# EAGLE design SparkFun_Pro_Micro-FP (EAGLE 9.5.1)
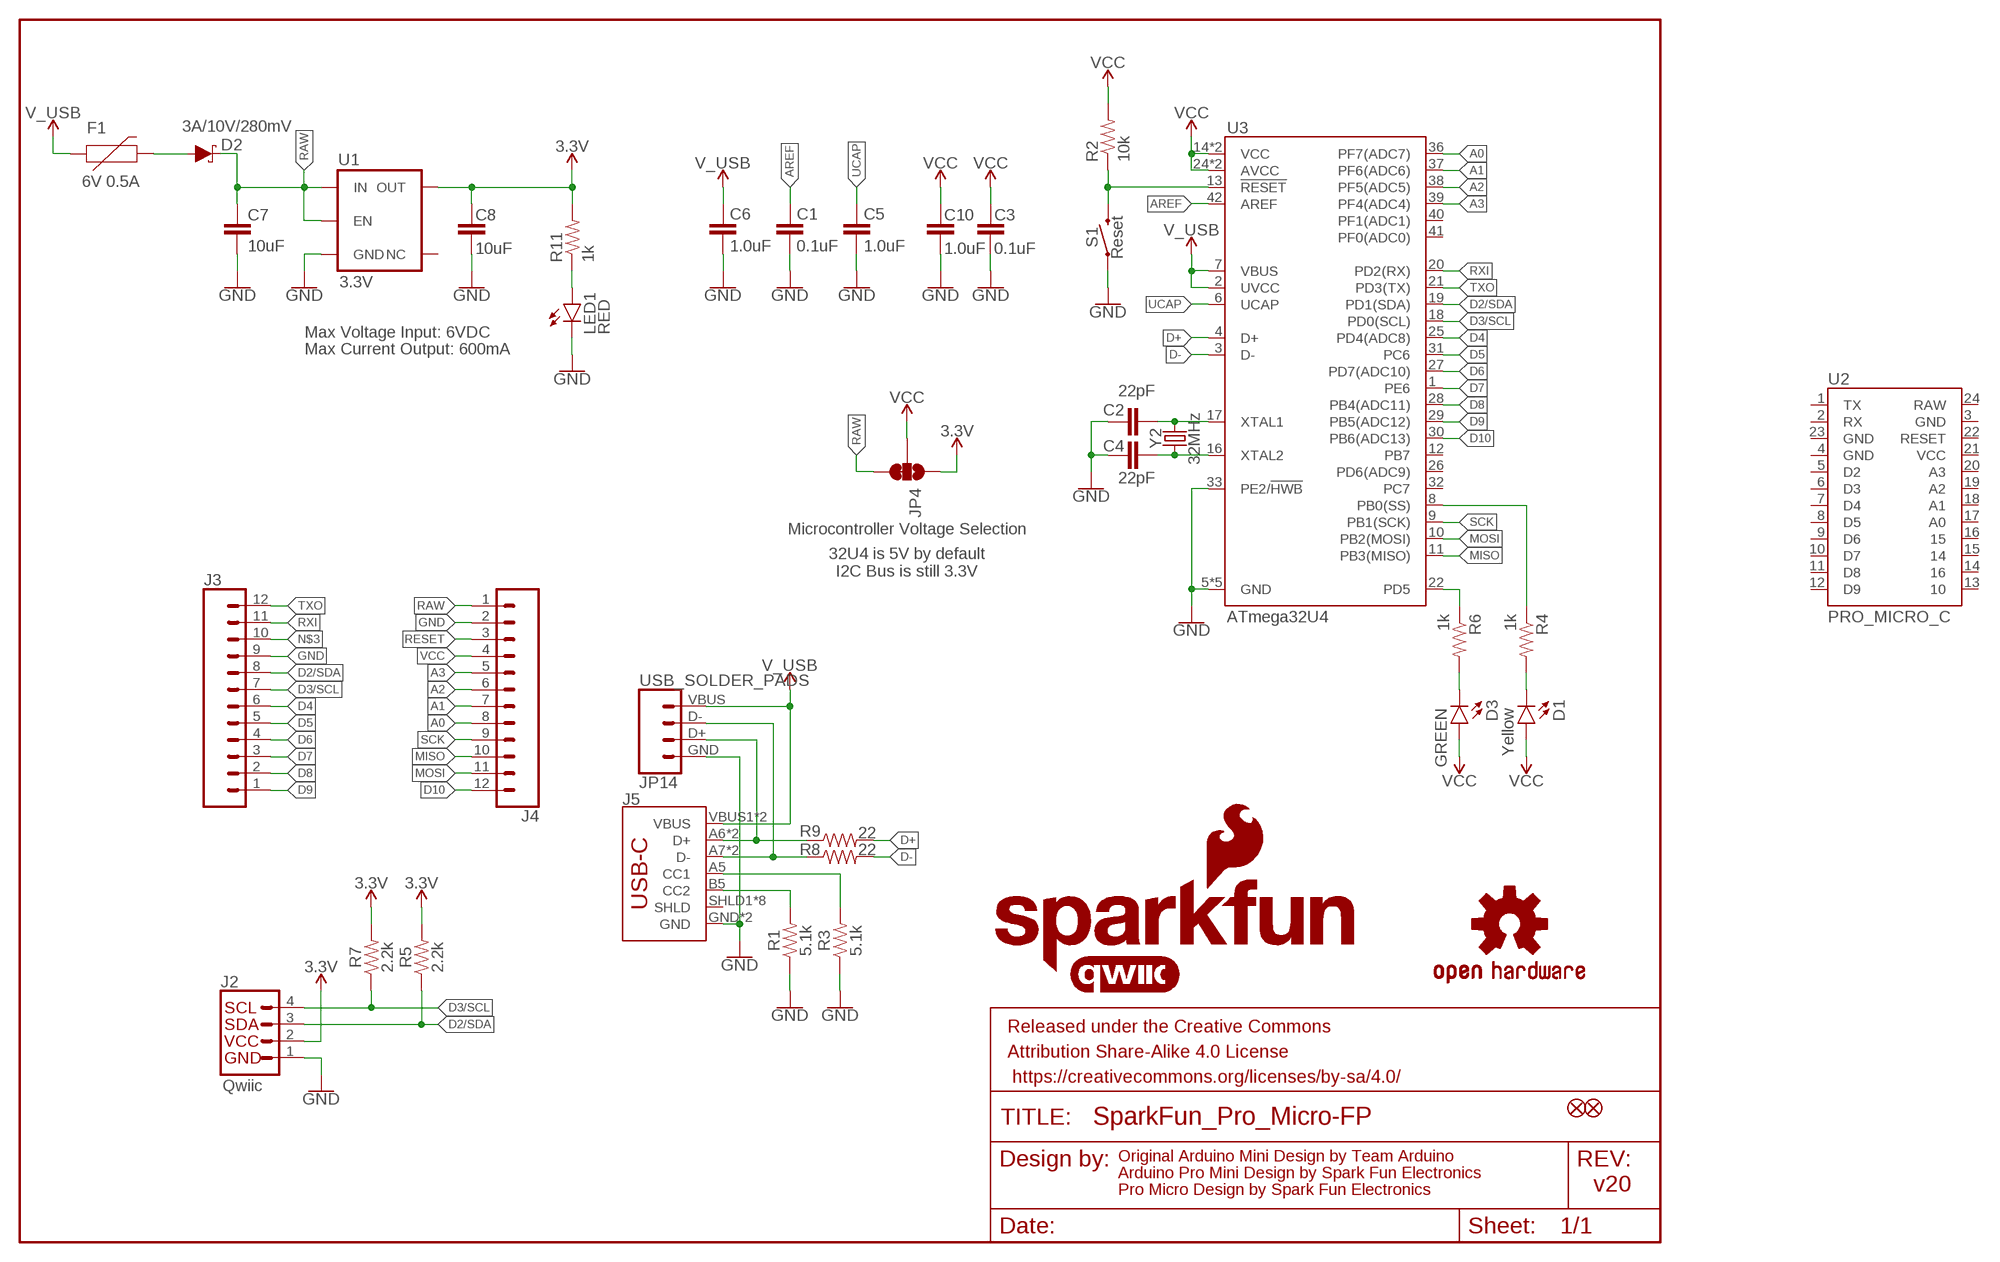
[diagram p0: schematic, sheet 1]

## Parts
C1  0.1uF  0.1UF-0402T-16V-10%  [0402-TIGHT]
C2  22pF  22PF-0402T-16V-10%  [0402-TIGHT]
C3  0.1uF  0.1UF-0402T-16V-10%  [0402-TIGHT]
C4  22pF  22PF-0402T-16V-10%  [0402-TIGHT]
C5  1.0uF  1.0UF-0402T-16V-10%  [0402-TIGHT]
C6  1.0uF  1.0UF-0402T-16V-10%  [0402-TIGHT]
C7  10uF  10UF-0603-6.3V-20%  [0603]
C8  10uF  10UF-0603-6.3V-20%  [0603]
C10  1.0uF  1.0UF-0402T-16V-10%  [0402-TIGHT]
D1  Yellow  LED-YELLOW0603  [LED-0603]
D2  3A/10V/280mV  DIODE-SCHOTTKY-BAT60A  [SOD-323]
D3  GREEN  LED-GREEN0603  [LED-0603]
F1  6V 0.5A  PPTC_6V500MA  [0805]
FRAME1  FRAME-LETTER  [CREATIVE_COMMONS]
J2  Qwiic  QWIIC_CONNECTORJS-1MM  [JST04_1MM_RA]
J3  CONN_12CASTLE  [1X12_CASTELLATED]
J4  CONN_12CASTLE  [1X12_CASTELLATED]
J5  USB_C5  [USB-C-16P-5]
JP1  FIDUCIAL1X2  [FIDUCIAL-1X2]
JP2  FIDUCIAL1X2  [FIDUCIAL-1X2]
JP4  JUMPER-SMT_3_1-NC_TRACE_SILK  [SMT-JUMPER_3_1-NC_TRACE_SILK]
JP14  USB_SOLDER_PADS  [USB-SOLDER-PADS]
LED1  RED  LED-RED0603  [LED-0603]
LOGO1  SFE_LOGO_NAME_FLAME.1_INCH  [SFE_LOGO_NAME_FLAME_.1]
LOGO2  QWIIC_LOGO_4MM  [QWIIC_4MM]
LOGO3  QWIIC_LOGO_6MM  [QWIIC_6MM]
LOGO4  SFE_LOGO_FLAME.1_INCH  [SFE_LOGO_FLAME_.1]
R1  5.1k  5.1KOHM-0402T-1/16W-1%  [0402-TIGHT]
R2  10k  10KOHM-0402T-1/16W-1%  [0402-TIGHT]
R3  5.1k  5.1KOHM-0402T-1/16W-1%  [0402-TIGHT]
R4  1k  1KOHM-0402T-1/16W-1%  [0402-TIGHT]
R5  2.2k  2.2KOHM-0402T-1/16W-1%  [0402-TIGHT]
R6  1k  1KOHM-0402T-1/16W-1%  [0402-TIGHT]
R7  2.2k  2.2KOHM-0402T-1/16W-1%  [0402-TIGHT]
R8  22  22OHM-0402T-1/16W-1%  [0402-TIGHT]
R9  22  22OHM-0402T-1/16W-1%  [0402-TIGHT]
R11  1k  1KOHM-0402T-1/16W-1%  [0402-TIGHT]
S1  Reset  MOMENTARY-SWITCH-SPST-SMD-4.6X2.8MM  [TACTILE_SWITCH_SMD_4.6X2.8MM]
U1  3.3V  V_REG_AP2112K-3.3V  [SOT23-5]
U2  PRO_MICRO_C  [PRO_MICRO_C]
U3  ATmega32U4  ATMEGA32U41:1  [QFN-44-NOPAD_1:1]
U$3  OSHW-LOGOMINI  [OSHW-LOGO-MINI]
Y2  32MHz  CRYSTAL-32MHZ-SMD-2.0X1.6MM  [CRYSTAL-SMD-2.0X1.6MM]

## Nets
3.3V: C8.2 J2.2 JP4.1 R5.2 R7.2 R11.2 U1.5(OUT)
A0: J4.8 U3.36(PF7(ADC7))
A1: J4.7 U3.37(PF6(ADC6))
A2: J4.6 U3.38(PF5(ADC5))
A3: J4.5 U3.39(PF4(ADC4))
AREF: C1.2 U3.42(AREF)
D2/SDA: J2.3 J3.8 R5.1 U3.19(PD1(SDA))
D3/SCL: J2.4 J3.7 R7.1 U3.18(PD0(SCL))
D4: J3.6 U3.25(PD4(ADC8))
D5: J3.5 U3.31(PC6)
D6: J3.4 U3.27(PD7(ADC10))
D7: J3.3 U3.1(PE6)
D8: J3.2 U3.28(PB4(ADC11))
D9: J3.1 U3.29(PB5(ADC12))
D10: J4.12 U3.30(PB6(ADC13))
D+: R9.2 U3.4(D+)
D-: R8.2 U3.3(D-)
D-_HV: J5.A7(D-) J5.B7(D-) JP14.D- R8.1
DP_HV: J5.A6(D+) J5.B6(D+) JP14.D+ R9.1
GND: C1.1 C2.2 C3.1 C4.2 C5.1 C6.1 C7.1 C8.1 C10.1 J2.1 J3.9 J4.2 J5.GND J5.GND2(GND) JP14.GND LED1.C R1.1 R3.1 S1.1 S1.2 U1.2(GND) U3.5(GND) U3.15(GND) U3.23(GND) U3.33(PE2/!HWB) U3.35(GND) U3.43(GND)
MISO: J4.10 U3.11(PB3(MISO))
MOSI: J4.11 U3.10(PB2(MOSI))
N$1: C4.1 U3.16(XTAL2) Y2.1
N$2: C2.1 U3.17(XTAL1) Y2.3
N$3: J3.10
N$5: D1.C R4.2
N$7: D3.C R6.2
N$9: J5.A5(CC1) R3.2
N$10: J5.B5(CC2) R1.2
N$38: LED1.A R11.1
RAW [vcc]: C7.2 D2.C J4.1 JP4.3 U1.1(IN) U1.3(EN)
RESET: J4.3 R2.1 S1.3 S1.4 U3.13(!RESET)
RXI: J3.11 U3.20(PD2(RX))
RXLED: R4.1 U3.8(PB0(SS))
SCK: J4.9 U3.9(PB1(SCK))
TXLED: R6.1 U3.22(PD5)
TXO: J3.12 U3.21(PD3(TX))
UCAP: C5.2 U3.6(UCAP)
USB_RAW: D2.A F1.2
V_USB: C6.2 F1.1 J5.VBUS1(VBUS) J5.VBUS2(VBUS) JP14.VBUS U3.2(UVCC) U3.7(VBUS)
VCC: C3.2 C10.2 D1.A D3.A J4.4 JP4.2 R2.2 U3.14(VCC) U3.24(AVCC) U3.34(VCC) U3.44(AVCC)
Unconnected: J5.SHLD1(SHLD) J5.SHLD2(SHLD) J5.SHLD3(SHLD) J5.SHLD4(SHLD) J5.SHLD5(SHLD) J5.SHLD6(SHLD) J5.SHLD7(SHLD) J5.SHLD8(SHLD) U1.4(NC) U2.1(TX) U2.2(RX) U2.3(GND) U2.4(GND) U2.5(D2) U2.6(D3) U2.7(D4) U2.8(D5) U2.9(D6) U2.10(D7) U2.11(D8) U2.12(D9) U2.13 U2.14 U2.15 U2.16 U2.17(A0) U2.18(A1) U2.19(A2) U2.20(A3) U2.21(VCC) U2.22(RESET) U2.23(GND) U2.24(RAW) U3.12(PB7) U3.26(PD6(ADC9)) U3.32(PC7) U3.40(PF1(ADC1)) U3.41(PF0(ADC0))

## Notes on the sheet
- Max Voltage Input: 6VDC
- Max Current Output: 600mA
- Microcontroller Voltage Selection
- 32U4 is 5V by default
  I2C Bus is still 3.3V
- Original Arduino Mini Design by Team Arduino
- Arduino Pro Mini Design by Spark Fun Electronics
- Pro Micro Design by Spark Fun Electronics | v20

## Library data of the parts
C1 C3 = SparkFun-Capacitors:0.1UF: 0.1µF ceramic capacitors A capacitor is a passive two-terminal electrical component used to store electrical energy temporarily in an electric field.; PROD_ID: CAP-12416
C2 C4 = SparkFun-Capacitors:22PF: 22pF ceramic capacitors A capacitor is a passive two-terminal electrical component used to store electrical energy temporarily in an electric field.; PROD_ID: CAP-14674
C5 C6 C10 = SparkFun-Capacitors:1.0UF: 1µF ceramic capacitors A capacitor is a passive two-terminal electrical component used to store electrical energy temporarily in an electric field.; PROD_ID: CAP-12417
C7 C8 = SparkFun-Capacitors:10UF: 10.0µF ceramic capacitors A capacitor is a passive two-terminal electrical component used to store electrical energy temporarily in an electric field.; PROD_ID: CAP-11015
D1 = SparkFun-LED:LED-YELLOW: Yellow SMD LED Used in manufacturing several products at SparkFun. Packages: 0603 - SMD 0603 package[Product Link] <http://www.kingbrightusa.com/product.asp?catalog_name=LED&product_id=APT1608SYCK> 0603 -SMART - SMART SMD 0603 package (more efficient/more expensive) [Product Link] <http://www.osram-os.com/osram_os/en/products/product-catalog/led-light-emitting-diodes/smartled-0603/ly-l29k/index.jsp> LilyPad - SMD1206 package[Product Datasheet] <https://www.sparkfun.com/datasheets/DevTools/LilyPad/Q150YUS4.pdf> SparkFun Products: Blynk Board <https://www.sparkfun.com/products/13794> IOIO-OTG <https://www.sparkfun.com/products/13613> XBee Explorer Serial <https://www.sparkfun.com/products/13225>; PROD_ID: DIO-09003
D2 = SparkFun-DiscreteSemi:DIODE-SCHOTTKY: Schottky diode A Schottky diode is a semiconductor diode which has a low forward voltage drop and a very fast switching action.; PROD_ID: DIO-14072
D3 = SparkFun-LED:LED-GREEN: Green SMD LED Used in manufacturing of various products at SparkFun Packages: 0603 - SMD 0603 package [Product Link] <http://www.futureelectronics.com/en/technologies/semiconductors/optoelectronics/leds/Pages/9894312-LTST-C190GKT.aspx?CrossPart=HSMG-C190&IM=0> LilyPad 1206 - SMD1206 LilyPad package [Product Link] <http://www.futureelectronics.com/en/Technologies/Product.aspx?ProductID=IN150NGHARVATEKCORPORATION2049943&IM=0> 1206 - SMD1206 package [Product Link] <http://www.futureelectronics.com/en/technologies/semiconductors/optoelectronics/leds/Pages/8315665-LTST-C150KGKT.aspx?IM=0> 1206 Bottom Mount -SMD 1206 Bottom Mount [Product Link] <http://www.digikey.com/product-detail/en/lite-on-inc/LTST-C230KGKT/160-1456-1-ND/386854> SparkFun Products: Pro Mini 328 -5V <https://www.sparkfun.com/products/821> RedBoard <https://www.sparkfun.com/products/12757> MP3 Trigger <https://www.sparkfun.com/products/13720> Makey Makey <https://www.sparkfun.com/products/11076>; PROD_ID: DIO-00821
F1 = SparkFun-Fuses:PPTC: Resettable Fuse PPTC Resettable Fuse. Really a sort of resistor with a polymeric positive temperature coefficient whose resistance increases dramatically with an increase in temperature. When heated by the power passing through the resistance rises causing the current to be limited, protecting the circuit. This is achieved by the transition of the polymer from a crystalline to an amorphous state where the conductive carbon separates breaking the conductive pathways found in the cool crystalline structure. When a PPTC cools back down it resumes conducting letting the circuit turn back on. SparkFun Products: SparkFun RedBoard - Programmed with Arduino <https://www.sparkfun.com/products/12757> Pro Micro - 5V/16MHz <https://www.sparkfun.com/products/12640> Arduino Pro 328 - 5V/16MHz <https://www.sparkfun.com/products/10915> MP3 Trigger <https://www.sparkfun.com/products/13720>; PROD_ID: RES-13945
FRAME1 = SparkFun-Aesthetics:FRAME-LETTER: Schematic Frame - Letter Standard 8.5x11 US Letter frame
J2 = SparkFun-Connectors:QWIIC_CONNECTOR: SparkFun I2C Standard Qwiic Connector An SMD 1mm pitch JST connector makes it easy and quick (get it? Qwiic?) to connect I2C devices to each other. The Qwiic system <http://www.sparkfun.com/qwiic> enables fast and solderless connection between popular platforms and various sensors and actuators. We carry 200mm <https://www.sparkfun.com/products/14204>, 100mm <https://www.sparkfun.com/products/14205>, 50mm <https://www.sparkfun.com/products/14206>, and breadboard friendly <https://www.sparkfun.com/products/14207> Qwiic cables. We also offer 10 pcs strips <https://www.sparkfun.com/products/14323> the SMD connectors.; PROD_ID: CONN-13694; VALUE: QWIIC_RIGHT_ANGLE
J3 J4 = Castellated:CONN_12: Multi connection point. Often used as Generic Header-pin footprint for 0.1 inch spaced/style header connections On any of the 0.1 inch spaced packages, you can populate with these: Break Away Headers - Straight <https://www.sparkfun.com/products/116> (PRT-00116) Break Away Male Headers - Right Angle <https://www.sparkfun.com/products/553> (PRT-00553) Female Headers <https://www.sparkfun.com/products/115> (PRT-00115) Break Away Headers - Machine Pin <https://www.sparkfun.com/products/117> (PRT-00117) Break Away Female Headers - Swiss Machine Pin <https://www.sparkfun.com/products/743> (PRT-00743) For SCREWTERMINALS and SPRING TERMINALS visit here: Screw Terimnals on SparkFun.com <https://www.sparkfun.com/search/results?term=Screw+Terminals> (5mm/3.5mm/2.54mm spacing) This device is also useful as a general connection point to wire up your design to another part of your project. Our various solder wires solder well into these plated through hole pads. Hook-Up Wire - Assortment (Stranded, 22 AWG) <https://www.sparkfun.com/products/11375> (PRT-11375) Hook-Up Wire - Assortment (Solid Core, 22 AWG) <https://www.sparkfun.com/products/11367> (PRT-11367) View the entire wire category on our website here <https://www.sparkfun.com/categories/141> Special notes: Molex polarized connector foot print use with SKU : PRT-08231 with associated crimp pins and housings. 1MM SMD Version SKU: PRT-10208 NOTES ON THE VARIANTS LOCK and LOCK_LONGPADS... This footprint was designed to help hold the alignment of a through-hole component (i.e. 6-pin header) while soldering it into place. You may notice that each hole has been shifted either up or down by 0.005 of an inch from it's more standard position (which is a perfectly straight line). This slight alteration caused the pins (the squares in the middle) to touch the edges of the holes. Because they are alternating, it causes a "brace" to hold the component in place. 0.005 has proven to be the perfect amount of "off-center" position when using our standard breakaway headers. Although looks a little odd when you look at the bare footprint, once you have a header in there, the alteration is very hard to notice. Also,if you push a header all the way into place, it is covered up entirely on the bottom side.
J5 = USBC:USB_C: USB Type C 16Pin Connector Super Speed pins not available on the 16-pin purely SMD connector so this part is best for USB 2.0 implementations. D1 and D2 are tied together enabling D+/- no matter which way the cable is plugged into the connector. The two channel configuration pins (CC1/2) are exposed. These are normally connected to ground via 5.1k resistors but can be reconfigured for high current/high power applications.
JP1 JP2 = SparkFun-Aesthetics:FIDUCIAL: Fiducial Alignment Points Point-of-reference for pick-and-place machines and other optical instruments.
JP4 = SparkFun-Jumpers:JUMPER-SMT_3_1-NC_TRACE: Normally closed trace jumper (1 of 2 connections) This jumper has a trace between two pads so it's normally closed (NC). The other connection is normally open (NO). Use a razor knife to open the connection. For best results follow the IPC guidelines for cutting traces: Cutout at least 0.063 mm (0.005 in). Remove all loose material to clean up the cut area. Seal the cut with an approved epoxy. Reapply solder to reclose the connection, or to close the NO connection.
JP14 = SparkFun-Connectors:USB_SOLDER_PADS: Solder pad access to USB pins. Helpful to expose on PCBs so user can attach external USB connector if necessary.
LED1 = SparkFun-LED:LED-RED: Red SMD LED Used in manufacturing of most products at SparkFun Packages: 0603 - SMD 0603 package [Product Link] <http://docs.avagotech.com/docs/AV02-0551EN> 0603 SMART - SMD 0603 SMART package ( more efficient and expensive)[Product Link] <http://www.osram-os.com/Graphics/XPic2/00077099_0.pdf> 1206 - SMD1206 package [Product Link] <https://www.sparkfun.com/datasheets/DevTools/LilyPad/Q150OVS4.pdff> SparkFun Products: Pro Mini 328 -5V <https://www.sparkfun.com/products/821> RedBoard <https://www.sparkfun.com/products/12757> IOIO-OTG <https://www.sparkfun.com/products/13613>; PROD_ID: DIO-00819
LOGO1 = SparkFun-Aesthetics:SFE_LOGO_NAME_FLAME: SparkFun Font Logo w/ Flame This is the SparkFun full logo. The logo on the schematic will always be the same size; the package variant is the height of the flame part of the logo. Default layer for the logo on the board is tSilk.
LOGO2 LOGO3 = SparkFun-Aesthetics:QWIIC_LOGO: Qwiic Logos for placement on schematic and PCB. The 5.5mm silk logo is best for placing next to Qwiic connector.
LOGO4 = SparkFun-Aesthetics:SFE_LOGO_FLAME: SparkFun Flame Logo This is the SparkFun flame logo. The logo on the schematic will always be the same size; the package variant is the height of the flame. Default layer for the logo on the board is tSilk.
R1 R3 = SparkFun-Resistors:5.1KOHM; PROD_ID: RES-14340
R2 = SparkFun-Resistors:10KOHM: 10kΩ resistor A resistor is a passive two-terminal electrical component that implements electrical resistance as a circuit element. Resistors act to reduce current flow, and, at the same time, act to lower voltage levels within circuits. - Wikipedia; PROD_ID: RES-14241
R4 R6 R11 = SparkFun-Resistors:1KOHM: 1kΩ resistor A resistor is a passive two-terminal electrical component that implements electrical resistance as a circuit element. Resistors act to reduce current flow, and, at the same time, act to lower voltage levels within circuits. - Wikipedia; PROD_ID: RES-14342
R5 R7 = SparkFun-Resistors:2.2KOHM: 2.2kΩ resistor A resistor is a passive two-terminal electrical component that implements electrical resistance as a circuit element. Resistors act to reduce current flow, and, at the same time, act to lower voltage levels within circuits. - Wikipedia; PROD_ID: RES-14341
R8 R9 = SparkFun-Resistors:22OHM: 22Ω resistor A resistor is a passive two-terminal electrical component that implements electrical resistance as a circuit element. Resistors act to reduce current flow, and, at the same time, act to lower voltage levels within circuits. - Wikipedia; PROD_ID: RES-14340
S1 = SparkFun-Switches:MOMENTARY-SWITCH-SPST: Momentary Switch (Pushbutton) - SPST Normally-open (NO) SPST momentary switches (buttons, pushbuttons). Variants PTH-12MM - 12mm square, through-hole Momentary Pushbutton Switch - 12mm Square <https://www.sparkfun.com/products/9190> (COM-09190) PTH-6.0MM, PTH-6.0MM-KIT - 6.0mm square, through-hole Mini Pushbutton Switch <https://www.sparkfun.com/products/97> (COM-00097) KIT package intended for soldering kit's - only one side of pads' copper is exposed. PTH-RIGHT-ANGLE-KIT - Right-angle, through-hole Right Angle Tactile Button <https://www.sparkfun.com/products/10791> - Used on SparkFun BigTime Watch Kit <https://www.sparkfun.com/products/11734> SMD-12MM - 12mm square, surface-mount Tactile Button - SMD (12mm) <https://www.sparkfun.com/products/12993> (COM-12993) Used on SparkFun PicoBoard <https://www.sparkfun.com/products/11888> SMD-4.5MM - 4.5mm Square Trackball Switch Used on SparkFun Blackberry Trackballer Breakout <https://www.sparkfun.com/products/13169> SMD-4.6MMX2.8MM - 4.60mm x 2.80mm, surface mount Used on SparkFun SAMD21 Mini Breakout <https://www.sparkfun.com/products/13664> SMD-5.2MM, SMD-5.2-REDUNDANT - 5.2mm square, surface-mount Mini Pushbutton Switch - SMD <https://www.sparkfun.com/products/8720> (COM-08720) Used on Arduino Pro Mini <https://www.sparkfun.com/products/11114> REDUNDANT package connects both switch circuits together SMD-6.0X3.5MM - 6.0 x 3.5mm, surface mount Momentary Reset Switch SMD <https://www.sparkfun.com/products/8229> (COM-08229) SMD-6.2MM-TALL - 6.2mm square, surface mount Tactile Button - SMD (6mm) <https://www.sparkfun.com/products/12992> Used on SparkFun Digital Sandbox <https://www.sparkfun.com/products/12651> SMD-RIGHT-ANGLE - Right-angle, surface mount Used on SparkFun Block for Intel® Edison - Arduino <https://www.sparkfun.com/products/13036>; PROD_ID: SWCH-13065
U1 = SparkFun-IC-Power:V_REG_AP2112: AP2112 - 600mA CMOS LDO Regulator w/ Enable The AP2112 is CMOS process low dropout linear regulator with enable function, the regulator delivers a guaranteed 600mA (min.) continuous load current. Features Output Voltage Accuracy: ±1.5% Output Current: 600mA (Min.) Foldback Short Current Protection: 50mA Enable Function to Turn ON/OFF VOUT Low Dropout Voltage (3.3V): 250mV (Typ.) @IOUT=600mA Excellent Load Regulation: 0.2%/A (Typ.) Excellent Line Regulation: 0.02%/V (Typ.) Low Quiescent Current: 55μA (Typ.) Low Standby Current: 0.01μA (Typ.) Low Output Noise: 50μVRMS PSRR: 100Hz -65dB, 1kHz -65dB OTSD Protection Stable with 1.0μF Flexible Cap: Ceramic, Tantalum and Aluminum Electrolytic Operation Temperature Range: -40°C to 85°C ESD: MM 400V, HBM 4000V; PROD_ID: VREG-12457
U2 = Castellated:PRO_MICRO_C
U3 = SparkFun-IC-Microcontroller:ATMEGA32U4: Atmel MCU, 32KByte Atmel 44-pin 8-bit Microcontroller with 32KBytes of ISP Flash and USB Controller Datasheet <http://cdn.sparkfun.com/datasheets/Dev/Arduino/Boards/ATMega32U4.pdf> SparkFun Products LilyPad Arduino USB - ATmega32U4 Board <https://www.sparkfun.com/products/12049> (DEV-12049) Pro Micro - 5V/16MHz <https://www.sparkfun.com/products/12640> (DEV-12640) Pro Micro - 3.3V/8MHz <https://www.sparkfun.com/products/12587> (DEV-12587) Fio v3 - ATmega32U4 <https://www.sparkfun.com/products/11520> (DEV-11520) Qduino Mini <https://www.sparkfun.com/products/13614> (DEV-13614) Makey Makey - Standard Kit <https://www.sparkfun.com/products/11511> (WIG-11511) Makey Makey Deluxe Kit <https://www.sparkfun.com/products/11519> (WIG-11519); PROD_ID: IC-10828; VALUE: 32U4
U$3 = SparkFun-Aesthetics:OSHW-LOGO: Open-Source Hardware (OSHW) Logo This logo indicates the piece of hardware it is found on incorporates a OSHW license and/or adheres to the definition of open source hardware found here: http://freedomdefined.org/OSHW
Y2 = SparkFun-Clocks:CRYSTAL-32MHZ: 32MHz Crystal Digikey Example <http://www.digikey.com/product-detail/en/murata-electronics-north-america/XRCGB32M000F2P00R0/490-9769-1-ND/4952013> Frequency: 32MHz Frequency Stability: ±20ppm Frequency Tolerance: ±20ppm Load Capacitance: 6pF SparkFun Products SparkFun nRF52832 Breakout <https://www.sparkfun.com/products/13990>; PROD_ID: XTAL-13459

## Board
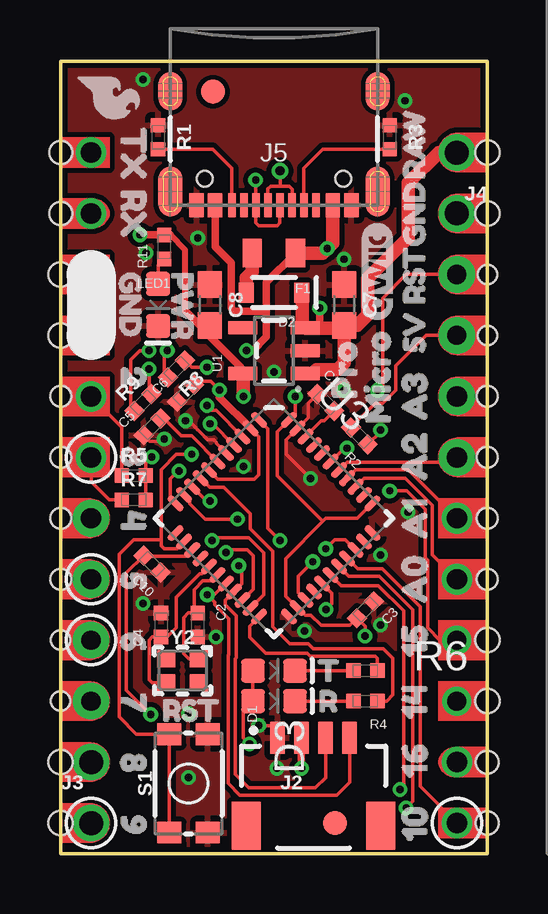
[diagram p1: board, top side]
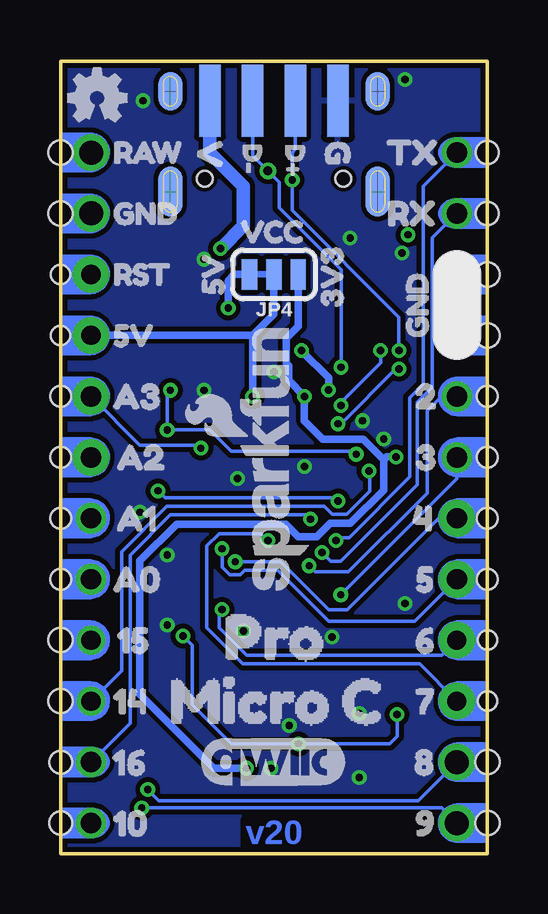
[diagram p2: board, bottom side, seen from below]

Size 17.78 x 33.02 mm. Coordinates in mm from the lower left corner, seen from the top.
Outline: 0,33.02 0,0 17.78,0 17.78,33.02 0,33.02
Copper layers (1*16): Top 0.035mm / dielectric 1.5mm / Bottom 0.035mm
Design rules "SparkFun-2-layer-PCBWay-LIMIT": minimum track width 6mil, minimum drill 0.3mm, track to track 6mil, track to pad 6mil, pad to pad 6mil, via to via 6mil, smd to smd 6mil, copper to edge 6mil, drill to drill 6mil, minimum pad ring 6mil, minimum via ring 6mil, stop-mask expansion 4mil, vias tented up to drill 25mil, thermal gap 10mil

### Footprints (pad centres in the part's own frame; a part is rotated, then mirrored left to right if it is on the bottom)
0402-TIGHT = smd 0.6 x 0.6: 1 -0.5,0; 2 0.5,0
0603 = smd 1.1 x 1: 1 -0.85,0; 2 0.85,0
LED-0603 = smd 1 x 1: A -0.877,0; C 0.877,0
SOD-323 = smd 0.63 x 0.83: A 1.15,0; C -1.15,0
0805 = smd 0.8 x 1.2: 1 -0.9,0; 2 0.9,0
JST04_1MM_RA = smd 0.6 x 1.35: 1 -1.5,0; 2 -0.5,0; 3 0.5,0; 4 1.5,0 | smd 1.2 x 2: NC1 2.8,-3.675; NC2 -2.8,-3.675
1X12_CASTELLATED = drill 1 pad 1.524: 1 0,0; 2 0,2.54 | drill 0.8 pad 1.524: 3 0,5.08; 4 0,7.62 | drill 0.85 pad 1.524: 5 0,10.16; 6 0,12.7 | drill 0.85 pad 1.016: 7 0,15.24; 8 0,17.78; 11 0,25.4; 12 0,27.94 | drill 0.8 pad 1.016: 9 0,20.32; 10 0,22.86 | hole 1: -1.27,2.54; -1.27,0; -1.27,20.32; -1.27,22.86 | hole 0.8: -1.27,5.08; -1.27,7.62 | hole 0.85: -1.27,10.16; -1.27,12.7; -1.27,15.24; -1.27,17.78 | hole 0.95: -1.27,25.4; -1.27,27.94
USB-C-16P-5 = smd 0.3 x 1: A5 -1.25,-0.34; A6 -0.25,-0.34; A7 0.25,-0.34; A8 1.25,-0.34; B5 1.75,-0.34; B6 0.75,-0.34; B7 -0.75,-0.34; B8 -1.75,-0.34 | smd 0.6 x 1: GND -3.225,-0.34; GND2 3.225,-0.34; VBUS1 -2.45,-0.34; VBUS2 2.45,-0.34 | smd 1 x 2.1: SHLD1 -4.32,-0.915; SHLD2 4.32,-0.915 | smd 1 x 2.1 bottom: SHLD3 -4.32,-0.915; SHLD4 4.32,-0.915 | smd 1 x 1.6: SHLD5 -4.32,-5.095; SHLD8 4.32,-5.095 | smd 1 x 1.6 bottom: SHLD6 -4.32,-5.095; SHLD7 4.32,-5.095 | hole 0.65: -2.89,-1.445; 2.89,-1.445
FIDUCIAL-1X2 = smd 1 x 1: 1 0,0
SMT-JUMPER_3_1-NC_TRACE_SILK = smd 0.635 x 1.27: 1 -1.016,0; 2 0,0; 3 1.016,0
USB-SOLDER-PADS = smd 3 x 0.9: D+ 0,-0.889; D- 0,0.889; GND 0,-2.667; VBUS 0,2.667
TACTILE_SWITCH_SMD_4.6X2.8MM = smd 0.9 x 1: 1 -2.05,-0.8; 2 2.05,-0.8; 3 2.05,0.8; 4 -2.05,0.8
SOT23-5 = smd 0.55 x 1.2: 1 -0.95,-1.3; 2 0,-1.3; 3 0.95,-1.3; 4 0.95,1.3; 5 -0.95,1.3
PRO_MICRO_C = smd 1.524 x 1.27: 1 -8.89,12.7; 2 -8.89,10.16; 3 -8.89,7.62; 13 8.89,-15.24; 14 8.89,-12.7; 15 8.89,-10.16; 16 8.89,-7.62 | smd 1.524 x 1.524: 4 -8.89,5.08; 5 -8.89,2.54; 6 -8.89,0; 7 -8.89,-2.54 | smd 2.032 x 1.524: 8 -8.89,-5.08; 9 -8.89,-7.62; 10 -8.89,-10.16; 11 -8.89,-12.7; 12 -8.89,-15.24 | smd 2.54 x 2.032: 17 8.89,-5.08; 18 8.89,-2.54; 19 8.89,0; 20 8.89,2.54 | smd 2.54 x 1.27: 21 8.89,5.08; 22 8.89,7.62 | smd 2.032 x 1.27: 23 8.89,10.16; 24 8.89,12.7
QFN-44-NOPAD_1:1 = smd 0.8 x 0.3: 1 -3.337,2.458; 2 -3.337,1.958; 3 -3.337,1.479; 4 -3.337,0.979; 5 -3.337,0.5; 6 -3.337,0; 7 -3.337,-0.5; 8 -3.337,-0.979; 9 -3.337,-1.479; 10 -3.337,-1.958; 11 -3.337,-2.458; 23 3.337,-2.458; 24 3.337,-1.958; 25 3.337,-1.479; 26 3.337,-0.979; 27 3.337,-0.5; 28 3.337,0; 29 3.337,0.5; 30 3.337,0.979; 31 3.337,1.479; 32 3.337,1.958; 33 3.337,2.458 | smd 0.3 x 0.8: 12 -2.458,-3.337; 13 -1.958,-3.337; 14 -1.479,-3.337; 15 -0.979,-3.337; 16 -0.5,-3.337; 17 0,-3.337; 18 0.5,-3.337; 19 0.979,-3.337; 20 1.479,-3.337; 21 1.958,-3.337; 22 2.458,-3.337; 34 2.458,3.337; 35 1.958,3.337; 36 1.479,3.337; 37 0.979,3.337; 38 0.5,3.337; 39 0,3.337; 40 -0.5,3.337; 41 -0.979,3.337; 42 -1.479,3.337; 43 -1.958,3.337; 44 -2.458,3.337
CRYSTAL-SMD-2.0X1.6MM = smd 0.75 x 0.7: 1 -0.675,-0.5; 2 0.675,-0.5; 3 0.675,0.5; 4 -0.675,0.5

### Placement (x,y rotation side)
C1  11.05,18.8 315 top
C2  5.71,9.53 270 top
C3  12.7,10.16 225 top
C4  4.19,9.53 90 top
C5  3.81,17.78 45 top
C6  5.21,19.18 45 top
C7  11.81,22.86 270 top
C8  6.22,22.86 270 top
C10  3.81,12.06 135 top
D1  8.89,6.35 0 top
D2  8.89,23.37 180 top
D3  8.89,7.62 0 top
F1  8.89,25.02 180 top
FRAME1  -17.25,-10.16 0 top  (outside the outline)
J2  10.54,4.83 0 top
J3  1.27,1.27 0 top
J4  16.51,29.21 180 top
J5  8.89,26.67 180 top
JP1  11.43,1.27 0 top
JP2  6.35,31.75 0 top
JP4  8.89,24.13 180 bottom
JP14  8.89,31.37 90 bottom
LED1  4.06,22.86 270 top
LOGO1  8.89,16.51 90 bottom
LOGO2  13.21,24.26 90 top
LOGO3  8.89,3.81 0 bottom
LOGO4  2.03,31.5 270 top
R1  4.06,29.84 270 top
R2  12.45,17.4 135 top
R3  13.72,29.84 270 top
R4  12.7,6.35 180 top
R5  3.05,15.75 0 top
R6  12.7,7.62 180 top
R7  3.05,14.73 0 top
R8  4.83,20.19 225 top
R9  3.43,18.8 45 top
R11  4.32,25.27 90 top
S1  5.33,2.92 90 top
U1  8.89,20.95 90 top
U2  -15.24,16.51 0 top  (outside the outline)
U3  8.89,13.97 315 top
U$1  [VCC1]  11.05,25.91 0 bottom
U$2  [156]  14.73,7.11 90 top
U$3  16.26,31.5 0 bottom
U$4  [164]  14.73,2.29 90 top
U$5  [218]  3.05,21.34 270 top
U$6  [317]  3.05,18.03 270 top
U$7  [515]  3.05,12.83 270 top
U$8  [614]  3.05,10.29 270 top
U$9  [713]  3.05,7.75 270 top
U$10  [812]  3.05,5.08 270 top
U$11  [GND4]  2.92,25.15 270 top
U$12  [RAW5]  14.73,27.3 90 top
U$13  [45]  3.05,15.37 270 top
U$14  [T8]  9.91,7.62 0 top
U$15  [5V1]  16.38,21.59 0 bottom
U$16  [911]  3.05,2.67 270 top
U$17  [A07]  14.73,9.53 90 top
U$18  [TX2]  3.05,31.11 270 top
U$19  [A18]  14.73,12.06 90 top
U$20  [PRODUCTION_INSTRUCTIONS]  20.32,50.8 0 top  (outside the outline)
U$21  [104]  14.73,-0.38 90 top
U$22  [GND4]  14.73,24.38 90 top
U$23  [MICRO1]  13.21,17.02 90 top
U$24  [PRO0]  11.81,18.03 90 top
U$25  [RST3]  3.43,5.97 0 top
U$26  [A29]  14.73,14.48 90 top
U$27  [A310]  14.73,17.14 90 top
U$28  [RX20]  3.05,28.57 270 top
U$29  [145]  14.73,4.7 90 top
U$30  [R9]  9.78,6.35 0 top
U$31  [RST3]  14.73,22.1 90 top
U$32  [GND4]  16.51,26.67 0 bottom
U$34  [A310]  16.51,19.05 0 bottom
U$35  [A29]  16.51,16.51 0 bottom
U$36  [A18]  16.51,13.97 0 bottom
U$37  [A07]  16.51,11.43 0 bottom
U$38  [156]  16.51,8.89 0 bottom
U$39  [3V39]  6.48,21.97 90 bottom
U$40  [C5]  8,6.35 0 bottom
U$41  [RST3]  16.38,24.13 0 bottom
U$42  [G1]  6.22,30.61 270 bottom
U$43  [MICRO4]  14.86,6.35 0 bottom
U$44  [V0]  11.56,30.61 270 bottom
U$45  [PRO3]  12.57,9.02 0 bottom
U$46  [RAW5]  16.38,29.21 0 bottom
U$47  [145]  16.51,6.35 0 bottom
U$48  [164]  16.51,3.81 0 bottom
U$49  [104]  16.51,1.27 0 bottom
U$50  [911]  4.06,1.27 0 bottom
U$51  [812]  3.94,3.81 0 bottom
U$52  [713]  4.06,6.35 0 bottom
U$53  [614]  4.06,8.89 0 bottom
U$54  [515]  4.06,11.43 0 bottom
U$55  [45]  4.19,13.97 0 bottom
U$56  [317]  4.06,16.51 0 bottom
U$57  [218]  4.06,19.05 0 bottom
U$58  [GND4]  2.92,20.57 90 bottom
U$59  [RX20]  5.08,26.67 0 bottom
U$60  [TX2]  5.08,29.21 0 bottom
U$61  [D#3]  8,30.23 270 bottom
U$62  [D#4]  9.78,30.23 270 bottom
U$63  [PWR0]  5.08,25.02 270 top
U$64  [5V1]  11.43,22.48 90 bottom
U$65  [5V1]  14.73,20.07 90 top
Y2  5.08,7.62 0 top

### Tracks (layer width: path | path; a pad name or v marks a point on that pad's centre or on a via)
3.3V  (via drill 0.3)
  Top 0.152: 6.22,21.59 C8.2 | U1.5 7.51,20 | R7.2 R5.2 3.55,16.3 3.78,16.53 v3.8,16.53
  Top 0.254: 5.21,22.6 5.19,22.62 5.19,25.15 4.56,25.77
  Top 0.305: 6.22,21.59 5.97,21.84 | 5.97,21.84 5.21,22.6 | 5.97,21.84 5.97,21.81 7.51,20.27 7.51,20 | 4.56,25.77 R11.2 v3.29,25.77 v3.3,25.78 | v10.03,3.56 10.03,4.82 J2.2
  Top 0.559: U1.5 7.62,19.98 v7.62,19.05
  Bottom 0.305: 4.32,16.41 4.32,15.14 5.71,13.75 6.55,13.75 7.11,13.2 7.87,13.2 8.41,13.73 12.94,13.73 14.48,12.19 14.48,6.63 11.4,3.56 v10.03,3.56 | 4.32,16.41 5.18,17.27 6.86,17.27 7.62,18.03 v7.62,19.05 8.28,19.71 8.28,20.32 8.38,20.42 8.38,21.46 7.87,21.97 JP4.1 | v3.8,16.53 4.2,16.53 4.32,16.41
A0
  Top 0.152: U3.36 12.66,15.65 14.35,15.65 15.49,14.5 15.49,12.45 J4.8
A1
  Top 0.152: U3.37 12.31,16 14.48,16 J4.7
A2
  Top 0.152: U3.38 11.93,16.31 16.31,16.31 J4.6
A3  (via drill 0.3)
  Top 0.152: U3.39 11.81,16.89 v11.94,16.89
  Bottom 0.152: v11.94,16.89 11.94,17.02 14.48,17.02 J4.5
AREF
  Top 0.152: U3.42 10.86,18.03 10.99,18.03 C1.2
D2/SDA  (via drill 0.3)
  Top 0.152: v7.42,11.99 7.55,11.87 7.55,11.25 U3.19 6.86,10.55 6.86,10.36 7.32,9.9 7.32,8.16 7.28,8.13 7.28,3.3 7.84,2.74 10.62,2.74 11.04,3.17 J2.3 | R5.1 2.55,17.77 J3.8
  Bottom 0.152: J3.8 1.91,19.05 2.5,18.45 2.5,15.02 5.79,11.74 7.17,11.74 v7.42,11.99
D3/SCL  (via drill 0.3)
  Top 0.152: U3.18 6.41,10.78 v6.11,10.78 6.43,10.46 6.43,10.36 7.01,9.78 7.01,8.28 6.98,8.25 6.98,2.93 7.47,2.44 11.51,2.44 12.04,2.97 J2.4 | R7.1 2.03,14.73 1.27,15.49 J3.7
  Bottom 0.152: J3.7 1.27,15.62 v6.11,10.78
D4  (via drill 0.3)
  Top 0.152: U3.25 9.91,10.86 9.91,11.56 v10.51,12.16
  Bottom 0.152: v10.51,12.16 8.6,12.16 6.6,10.16 5.84,10.16 2.03,13.97 J3.6
D5  (via drill 0.3)
  Top 0.152: U3.31 11.87,13.08 11.43,13.08 v11.05,12.7
  Bottom 0.152: v11.05,12.7 11.06,12.68 11.04,12.66 11.04,11.94 10.73,11.62 10.29,11.62 10.1,11.81 8.74,11.81 6.6,9.68 3.02,9.68 J3.5
D6  (via drill 0.3)
  Top 0.152: U3.27 11.3,10.85 11.3,10.41 v11.05,10.16
  Bottom 0.152: v11.05,10.16 11.18,10.04 11.18,9.4 10.03,8.26 1.91,8.26 J3.4
D7  (via drill 0.3)
  Top 0.152: U3.1 8.64,17.7 8.64,13.55 v9.14,13.04
  Bottom 0.152: v9.14,13.04 9.44,13.34 11.18,13.34 11.68,12.83 11.68,9.4 10.19,7.9 2.82,7.9 J3.3
D8  (via drill 0.3)
  Top 0.152: U3.28 11.69,11.17 13.24,11.17 14.3,10.11 14.3,2.82 v14.15,2.67
  Bottom 0.152: v14.15,2.67 13.69,2.21 2.87,2.21 J3.2
D9  (via drill 0.3)
  Top 0.152: U3.29 12.01,11.56 13.29,11.56 14.68,10.16 14.68,2.19 v14.4,1.91
  Bottom 0.152: J3.1 1.91,1.91 v14.4,1.91
D10
  Top 0.152: U3.30 12.38,11.86 13.41,11.86 14.99,10.29 14.99,2.79 J4.12
D+  (via drill 0.3)
  Top 0.152: v6.22,17.91 6.34,17.91 U3.4 | R9.2 3.68,19.25 v3.68,20.19
  Bottom 0.152: v6.22,17.91 6.1,17.91 3.81,20.19 v3.68,20.19
D-  (via drill 0.3)
  Top 0.152: U3.3 6.49,18.47 6.3,18.47 v6.1,18.67 | v4.45,20.95 4.32,20.83 4.32,19.99 R8.2
  Bottom 0.152: v6.1,18.67 6.1,18.8 4.45,20.45 v4.45,20.95
D-_HV  (via drill 0.3, 0.38)
  Top 0.152: R8.1 5.46,20.26 v6.1,20.26 | J5.A7 8.64,27.69 8.76,27.81 9.14,27.81 | 9.14,27.81 9.53,27.81 9.65,27.69 9.65,27.02 J5.B7 | v9.14,28.45 9.14,27.81
  Bottom 0.152: v6.1,20.26 6.1,24.33 8.66,26.9 8.66,27.96 v9.14,28.45 9.78,29.08 JP14.D-
DP_HV  (via drill 0.3)
  Top 0.152: v8.13,28.07 8.14,28.05 J5.B6 8.13,27 8.13,26.29 8.26,26.16 9.02,26.16 9.14,26.29 J5.A6 | v3.68,20.95 3.3,20.95 2.92,20.57 2.92,18.6 R9.1
  Bottom 0.152: v3.68,20.95 3.68,22.35 8.13,26.8 v8.13,28.07 8.13,29.21 8,29.34 8,30.48 8.13,30.61 8.13,31.24 JP14.D+
GND  (via drill 0.3)
  Top 0.152: C1.1 10.31,18.77 10.31,18.16 U3.43 9.4,17.25 9.4,16.64 v10.41,15.62 | v5.21,18.03 5.33,17.91 5.47,17.91 6.13,17.25 6.38,17.25 6.48,17.14 6.48,17.09 U3.5 | J2.1 9.04,5.06 8.76,5.33 v8.26,5.33 | C5.1 3.71,17.17 4.22,17.17 v4.32,17.27
  other vias: 5.33,3.17 5.33,5.84 13.34,9.53 3.43,10.41 10.16,9.27 14.48,14.22 11.81,19.3 11.81,24.77 7.62,16.13 5.71,25.65 14.35,31.37 3.43,32.26 6.48,9.02 8.89,20.07 3.56,25.02 9.02,3.56 13.34,12.45
  pour Top (isolate 0.203): 0,33.02 17.78,33.02 17.78,0 0,0
  pour Bottom (isolate 0.203): 0,33.02 17.78,33.02 17.78,0 0,0
MISO  (via drill 0.3)
  Top 0.152: U3.11 4.57,14.81 4.57,15.62 4.89,15.94 v4.93,15.94
  Bottom 0.152: v4.93,15.94 4.9,15.91 4.9,15.1 5.87,14.13 6.45,14.13 6.79,14.46 13.35,14.46 15.24,12.58 15.24,7.62 J4.10
MOSI  (via drill 0.3)
  Top 0.152: U3.10 5.39,14.7 5.39,14.58 6.03,13.93 v7.37,13.93
  Bottom 0.152: v7.37,13.93 7.54,14.11 13.21,14.11 14.88,12.43 14.88,5.44 J4.11
N$1
  Top 0.152: Y2.1 4.4,7.11 3.81,7.11 3.68,7.24 3.68,8.89 3.82,9.03 C4.1 4.45,9.03 4.83,9.4 4.83,10.68 5.8,11.66 5.87,11.66 U3.16
N$2
  Top 0.152: Y2.3 5.34,8.12 5.13,8.33 5.13,9.83 5.33,10.03 C2.1 5.58,10.16 5.58,11 5.93,11.36 6.28,11.36 U3.17
N$5
  Top 0.152: D1.C R4.2
N$7
  Top 0.152: D3.C R6.2
N$9
  Top 0.152: R3.2 10.93,29.34 10.14,28.55 J5.A5
N$10
  Top 0.152: R1.2 6.34,29.34 7.14,28.55 J5.B5
N$38
  Top 0.152: R11.1 4.06,24.52 LED1.A
RAW  (via drill 0.3)
  Top 0.152: D2.C 10.06,23.34
  Top 0.305: v10.79,22.73 10.79,21.88
  Top 0.559: 10.06,23.34 10.06,22.03 U1.3 10.21,21.88 10.79,21.88 11.68,21.88 C7.2 | C7.2 12.36,22.01 12.81,22.46 12.81,23.98 14.48,25.65 14.48,27.94 15.75,29.21 J4.1 | U1.1 10.52,20 10.68,20.17 11.53,20.17 11.81,20.45 C7.2
  Bottom 0.305: JP4.3 10.54,24.13 10.79,23.88 v10.79,22.73
RESET  (via drill 0.3)
  Top 0.152: v13.21,19.3 13.42,19.51 13.42,23.15 14.4,24.13 J4.3 | U3.13 4.85,12.7 4.32,12.7 4.19,12.83 4.19,13.08 | v5.46,16.64 4.83,16.64 4.19,16 4.19,13.08 | S1.4 S1.3 3.16,4.97 2.44,5.69 2.44,12.47 3.05,13.08 4.19,13.08 | R2.1 13.34,17.58 v13.34,17.65
  Bottom 0.152: v5.46,16.64 5.59,16.76 10.67,16.76 11.56,17.65 v13.34,17.65 13.34,19.18 v13.21,19.3
RXI  (via drill 0.3)
  Top 0.152: U3.20 8.03,11.02 8.03,12.41 7.78,12.67 7.02,12.67 v6.89,12.54
  Bottom 0.152: v6.89,12.54 6.52,12.17 6.12,12.17 2.92,15.37 2.92,18.8 2.29,19.43 2.29,25.65 J3.11
RXLED
  Top 0.152: R4.1 13.58,6.35 13.84,6.61 13.84,8.13 13.44,8.53 10.52,8.53 10.32,8.74 9.55,8.74 8.83,9.46 8.83,12.59 7.9,13.53 7.9,14.15 6.8,15.25 6.22,15.25 U3.8
SCK  (via drill 0.3)
  Top 0.152: v6.22,14.69 6.08,14.69 U3.9 | J4.9 15.8,8.89 15.29,9.4 15.29,12.22 15.19,12.32 15.19,14.35 14.43,15.11 v13.72,15.11
  Bottom 0.152: v6.22,14.69 6.35,14.82 13.42,14.82 v13.72,15.11
TXLED
  Top 0.152: U3.22 7.87,9.48 7.87,9.02 8.54,8.35 10.27,8.35 10.39,8.23 13.11,8.23 13.2,8.14 R6.1
TXO  (via drill 0.3)
  Top 0.152: v6.31,13.04 6.43,13.16 7.83,13.16 8.46,12.53 8.46,10.78 U3.21
  Bottom 0.152: v6.31,13.04 6.18,13.16 5.76,13.16 3.23,15.7 3.23,19 2.67,19.56 2.67,27.81 J3.12
UCAP
  Top 0.152: U3.6 5.46,17.4 5.03,17.4 4.29,18.13 C5.2
USB_RAW
  Top 0.559: F1.2 7.99,24.25 7.74,24 D2.A
V_USB  (via drill 0.3)
  Top 0.152: C6.2 5.71,19.68 6.25,19.68 v6.62,19.32 6.62,19.14 | U3.2 8.26,17.37 8.26,15.79 8.06,15.6 6.56,15.6 U3.7 | 6.62,19.14
  Top 0.305: v7.75,20.95 8,20.95 8.57,21.52 8.57,22.61 | F1.1 8.57,23.8 8.57,22.61 | 8.57,22.61 7.24,22.61 7.1,22.74 7.1,24.62 6.44,25.28 J5.VBUS2 | U3.2 6.62,19.01 6.62,19.14
  Top 0.559: F1.1 10.92,25.02 v11.11,25.21 11.34,25.44 J5.VBUS1
  Bottom 0.305: v7.75,20.95 6.62,19.83 v6.62,19.32
  Bottom 0.559: JP14.VBUS 11.56,29.21 10.16,27.81 10.16,26.16 v11.11,25.21
VCC  (via drill 0.3)
  Top 0.152: D3.A D1.A 7.62,5.96 7.62,4.83 v7.87,4.57 | v9.78,19.05 9.78,18.34 U3.44 9.02,17.57 9.02,15.75 10.92,13.84 | U3.34 12.37,13.97 11.05,13.97 10.92,13.84 | 10.92,13.84 9.37,12.29 9.37,10.72 U3.24 9.9,10.23 10.2,9.92 10.43,9.92 10.85,9.5 12.04,9.5 C3.2 12.69,9.47 v12.69,9.07 | v3.76,5.79 2.74,6.81 2.74,11.71 C10.2 3.48,12.39 5.22,12.39 U3.14 | J4.4 15.24,21.59 13.97,20.32 13.97,19.31 13.43,18.77 13.11,18.77 R2.2
  Bottom 0.152: v3.76,5.79 3.76,4.88 4.06,4.57 v7.87,4.57 10.67,4.57 12.3,6.21 12.3,8.69 v12.69,9.07
  Bottom 0.305: 9.78,21.59 J4.4 | 9.78,21.59 v9.78,19.05 | 9.78,21.59 8.89,22.48 JP4.2

### Text on the board
Bottom: v20
tDocu: 0.8mm PCB | N. Seidle